# EAGLE schematic 4Bit Computer - 2 4Bit Input (EAGLE 7.6.0)
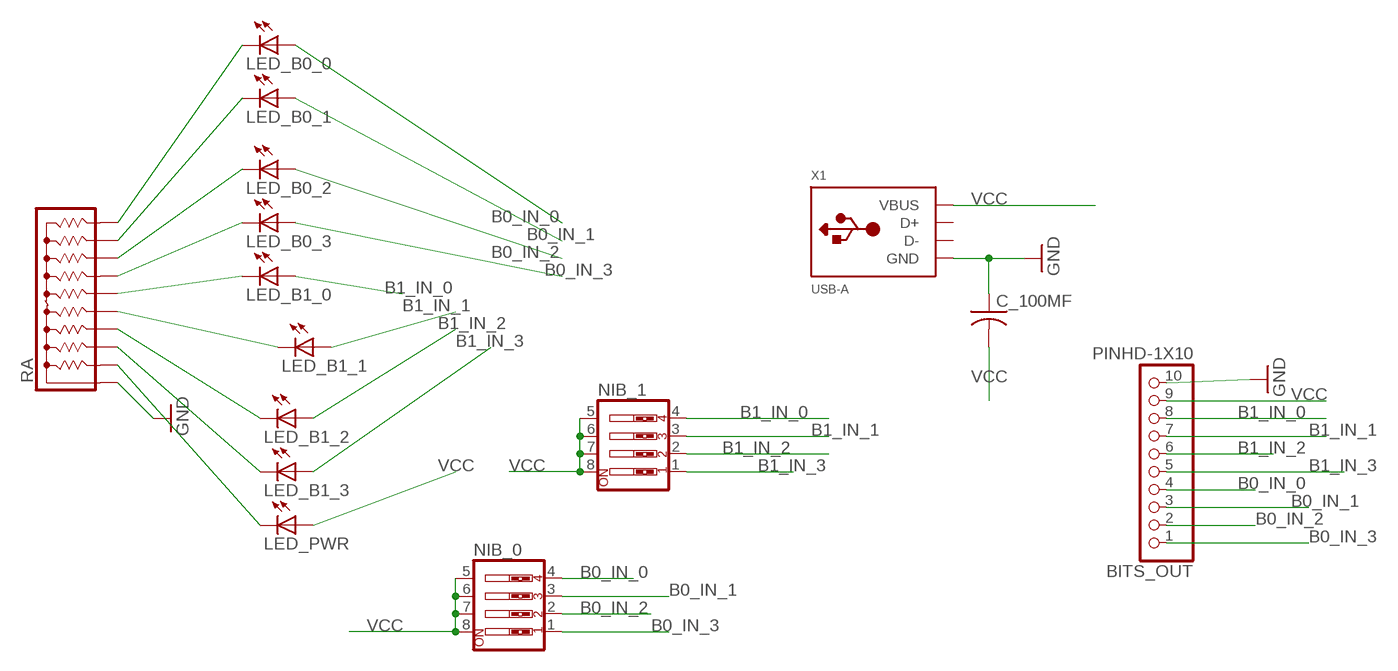
[diagram p0: schematic, sheet 1]

## Parts
BITS_OUT  PINHD-1X10  [1X10-BIG]
C_100MF  C-US025-030X050  [C025-030X050]
LED_B0_0  LEDSMT1206  [1206]
LED_B0_1  LEDSMT1206  [1206]
LED_B0_2  LEDSMT1206  [1206]
LED_B0_3  LEDSMT1206  [1206]
LED_B1_0  LEDSMT1206  [1206]
LED_B1_1  LEDSMT1206  [1206]
LED_B1_2  LEDSMT1206  [1206]
LED_B1_3  LEDSMT1206  [1206]
LED_PWR  LEDSMT1206  [1206]
NIB_0  SW_DIP-4  [EDG-04]
NIB_1  SW_DIP-4  [EDG-04]
RA  4610X  [SIP10]
X1  USB-A  [MOLEX_480371000]

## Nets
B0_IN_0: BITS_OUT.4 LED_B0_0.A NIB_0.4
B0_IN_1: BITS_OUT.3 LED_B0_1.A NIB_0.3
B0_IN_2: BITS_OUT.2 LED_B0_2.A NIB_0.2
B0_IN_3: BITS_OUT.1 LED_B0_3.A NIB_0.1
B1_IN_0: BITS_OUT.8 LED_B1_0.A NIB_1.4
B1_IN_1: BITS_OUT.7 LED_B1_1.A NIB_1.3
B1_IN_2: BITS_OUT.6 LED_B1_2.A NIB_1.2
B1_IN_3: BITS_OUT.5 LED_B1_3.A NIB_1.1
GND: BITS_OUT.10 C_100MF.1 RA.1 X1.4(GND)
N$1: LED_B0_0.C RA.10
N$2: LED_B0_1.C RA.9
N$3: LED_B0_2.C RA.8
N$4: LED_B0_3.C RA.7
N$5: LED_B1_0.C RA.6
N$6: LED_B1_1.C RA.5
N$7: LED_B1_2.C RA.4
N$8: LED_B1_3.C RA.3
N$10: LED_PWR.C RA.2
VCC: BITS_OUT.9 C_100MF.2 LED_PWR.A NIB_0.5 NIB_0.6 NIB_0.7 NIB_0.8 NIB_1.5 NIB_1.6 NIB_1.7 NIB_1.8 X1.1(VBUS)
Unconnected: X1.2(D-) X1.3(D+)

## Library data of the parts
BITS_OUT = adafruit:PINHD-1X10: Pin header 1x10 0.1" spacing With round pins
C_100MF = adafruit:C-US: CAPACITOR, American symbol
LED_B0_0 LED_B0_1-LED_B0_3 LED_B1_0 LED_B1_1-LED_B1_3 LED_PWR = adafruit:LED: LED OSRAM: - CHIPLED LG R971, LG N971, LY N971, LG Q971, LY Q971, LO R971, LY R971 LH N974, LH R974 LS Q976, LO Q976, LY Q976 LO Q996 - Hyper CHIPLED LW Q18S LB Q993, LB Q99A, LB R99A - SideLED LS A670, LO A670, LY A670, LG A670, LP A670 LB A673, LV A673, LT A673, LW A673 LH A674 LY A675 LS A676, LA A676, LO A676, LY A676, LW A676 LS A679, LY A679, LG A679 - Hyper Micro SIDELED® LS Y876, LA Y876, LO Y876, LY Y876 LT Y87S - SmartLED LW L88C, LW L88S LB L89C, LB L89S, LG L890 LS L89K, LO L89K, LY L89K LS L896, LA L896, LO L896, LY L896 - TOPLED LS T670, LO T670, LY T670, LG T670, LP T670 LSG T670, LSP T670, LSY T670, LOP T670, LYG T670 LG T671, LOG T671, LSG T671 LB T673, LV T673, LT T673, LW T673 LH T674 LS T676, LA T676, LO T676, LY T676, LB T676, LH T676, LSB T676, LW T676 LB T67C, LV T67C, LT T67C, LS T67K, LO T67K, LY T67K, LW E67C LS E67B, LA E67B, LO E67B, LY E67B, LB E67C, LV E67C, LT E67C LW T67C LS T679, LY T679, LG T679 LS T770, LO T770, LY T770, LG T770, LP T770 LB T773, LV T773, LT T773, LW T773 LH T774 LS E675, LA E675, LY E675, LS T675 LS T776, LA T776, LO T776, LY T776, LB T776 LHGB T686 LT T68C, LB T68C - Hyper Mini TOPLED® LB M676 - Mini TOPLED Santana® LG M470 LS M47K, LO M47K, LY M47K Source: http://www.osram.convergy.de/
NIB_0 NIB_1 = special:SW_DIP-4: DIP SWITCH
RA = resistor-sip:4610X: Bourns 4600X Series - Thick Film Conformal SIPs 4610X-101 Resistor Network Configuration: 101 (Bussed Resistors) Resistance range: 10 ohms to 10 Megaohms Maximum Operating Voltage: 100V Source: http://www.bourns.com/ProductLine.aspx?name=standard_thick_film_networks PDF: http://www.bourns.com/data/global/pdfs/4600X.pdf
X1 = adafruit:USB-A: USB type A 'plug' Used for things that can directly connect to a USB port, say USB key